# EAGLE design CC40_ROM_Cart (EAGLE 7.7.0)
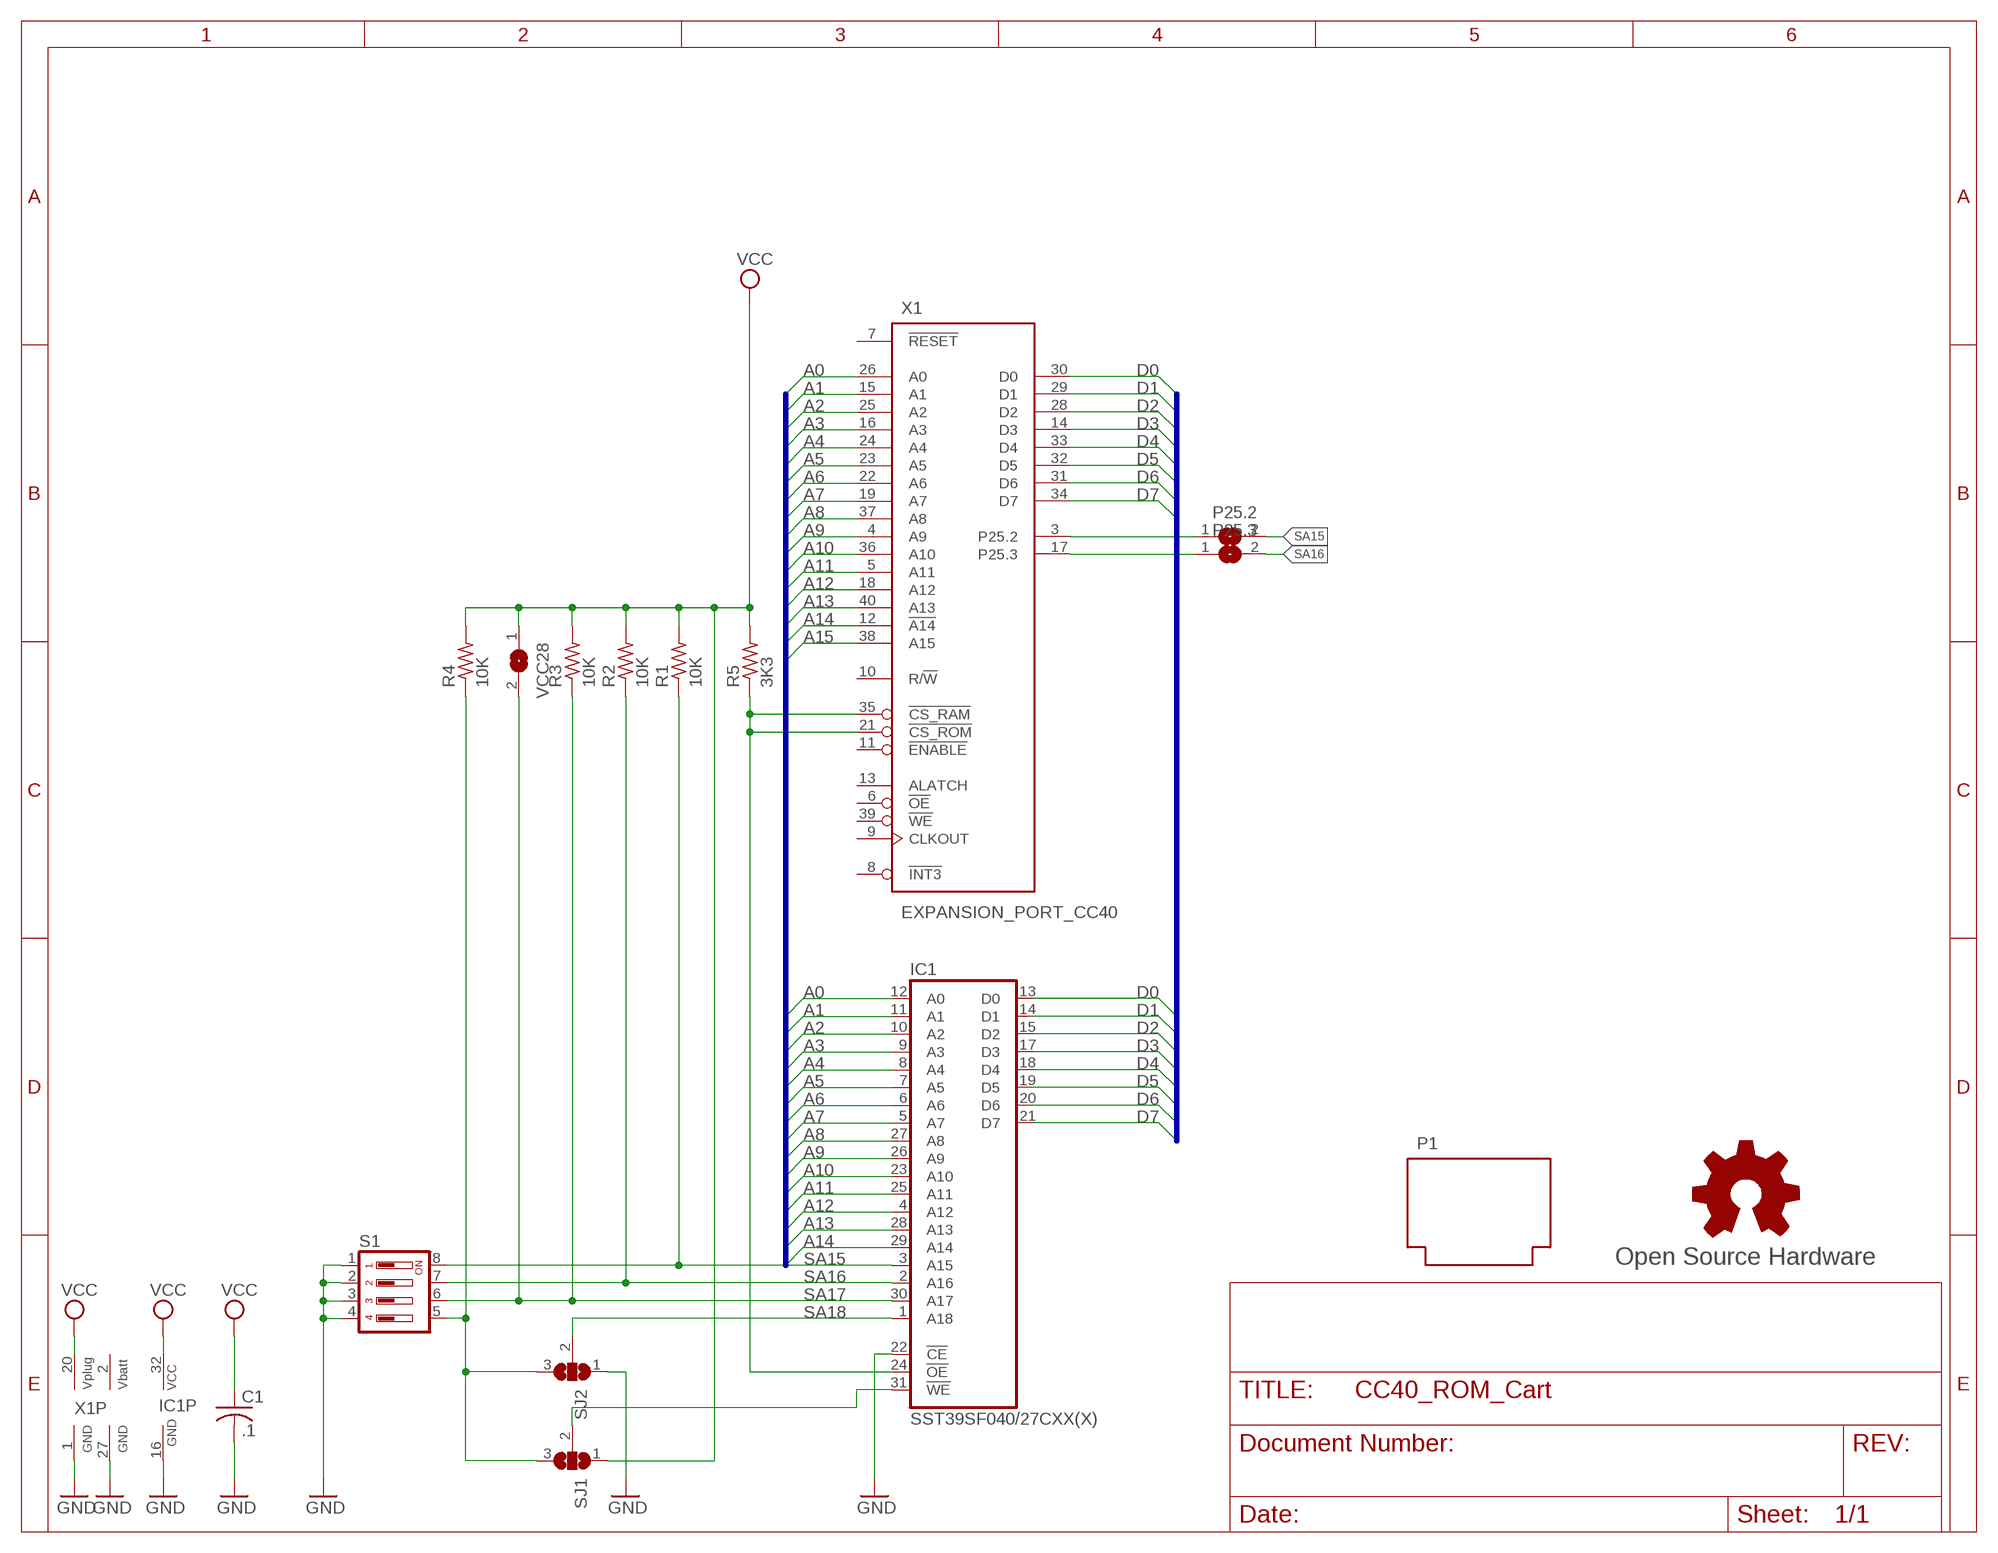
[diagram p0: schematic, sheet 1]

## Parts
C1  .1  C-US025-025X050  [C025-025X050]
GOLD_ORB_SM1  Open Source Hardware  OSHWLOGOLOGO8MM  [OSHW_8MM]
IC1  SST39SF040/27CXX(X)  SST39SF040APHR  [DIL32-RP]
P1  CC40_CARTN  [CC40_CART_NOHOLE]
P25.2  SJ  [SJ]
P25.3  SJ  [SJ]
R1  10K  R-US_0204/7  [0204/7]
R2  10K  R-US_0204/7  [0204/7]
R3  10K  R-US_0204/7  [0204/7]
R4  10K  R-US_0204/7  [0204/7]
R5  3K3  R-US_0204/7  [0204/7]
S1  DP04  [DP-04]
SJ1  SJ2W  [SJ_2]
SJ2  SJ2W  [SJ_2]
VCC28  SJ  [SJ]
X1  EXPANSION_PORT_CC40  [MA20-2(.050)]

## Nets
!CS: IC1.24(!OE) R5.1 X1.21(!CS_ROM) X1.35(!CS_RAM)
!WE: IC1.31(!WE) SJ1.2
A0: IC1.12(A0) X1.26(A0)
A1: IC1.11(A1) X1.15(A1)
A2: IC1.10(A2) X1.25(A2)
A3: IC1.9(A3) X1.16(A3)
A4: IC1.8(A4) X1.24(A4)
A5: IC1.7(A5) X1.23(A5)
A6: IC1.6(A6) X1.22(A6)
A7: IC1.5(A7) X1.19(A7)
A8: IC1.27(A8) X1.37(A8)
A9: IC1.26(A9) X1.4(A9)
A10: IC1.23(A10) X1.36(A10)
A11: IC1.25(A11) X1.5(A11)
A12: IC1.4(A12) X1.18(A12)
A13: IC1.28(A13) X1.40(A13)
A14: IC1.29(A14) X1.12(!A14)
A15: X1.38(A15)
D0: IC1.13(D0) X1.30(D0)
D1: IC1.14(D1) X1.29(D1)
D2: IC1.15(D2) X1.28(D2)
D3: IC1.17(D3) X1.14(D3)
D4: IC1.18(D4) X1.33(D4)
D5: IC1.19(D5) X1.32(D5)
D6: IC1.20(D6) X1.31(D6)
D7: IC1.21(D7) X1.34(D7)
GND: C1.2 IC1.16(GND) IC1.22(!CE) S1.1 S1.2 S1.3 S1.4 SJ2.1 X1.1(GND) X1.27(GND)
SA15: IC1.3(A15) P25.2.2 R1.1 S1.8
SA15': P25.2.1 X1.3(P25.2)
SA16: IC1.2(A16) P25.3.2 R2.1 S1.7
SA16': P25.3.1 X1.17(P25.3)
SA17: IC1.30(A17) R3.1 S1.6 VCC28.2
SA18: IC1.1(A18) SJ2.2
SA18': R4.1 S1.5 SJ1.3 SJ2.3
VCC: C1.1 IC1.32(VCC) R1.2 R2.2 R3.2 R4.2 R5.2 SJ1.1 VCC28.1 X1.20(VPLUG)
Unconnected: X1.6(!OE) X1.7(!RESET) X1.8(!INT3) X1.9(CLKOUT) X1.10(R/!W) X1.11(!ENABLE) X1.13(ALATCH) X1.39(!WE)

## Buses
A[0..15]
D[0..7]

## Power pins joined to a net without a drawn wire
VBATT: X1.2(VBATT)

## Library data of the parts
C1 = rcl:C-US: CAPACITOR, American symbol
GOLD_ORB_SM1 = oshw:OSHWLOGO: The OSHW logo for PCB layout
IC1 = memory-sst:SST39SF040A: 4 Mbit x8 Multi-Purpose Flash Source: http://www.sst.com/dotAsset/40782.pdf
P1 = ti-cc40-74-95:CC40_CART
P25.2 P25.3 VCC28 = jumper:SJ: SMD solder JUMPER
R1-R5 = rcl:R-US_: RESISTOR, American symbol
S1 = switch-dil-rp:DP04: DIL/CODE SWITCH; MPN: DP04; OC_FARNELL: 9471600; OC_NEWARK: 73J0027
SJ1 SJ2 = jumper:SJ2W: SMD solder JUMPER
X1 = ti-cc40-74-95:EXPANSION_PORT_CC40

## Board
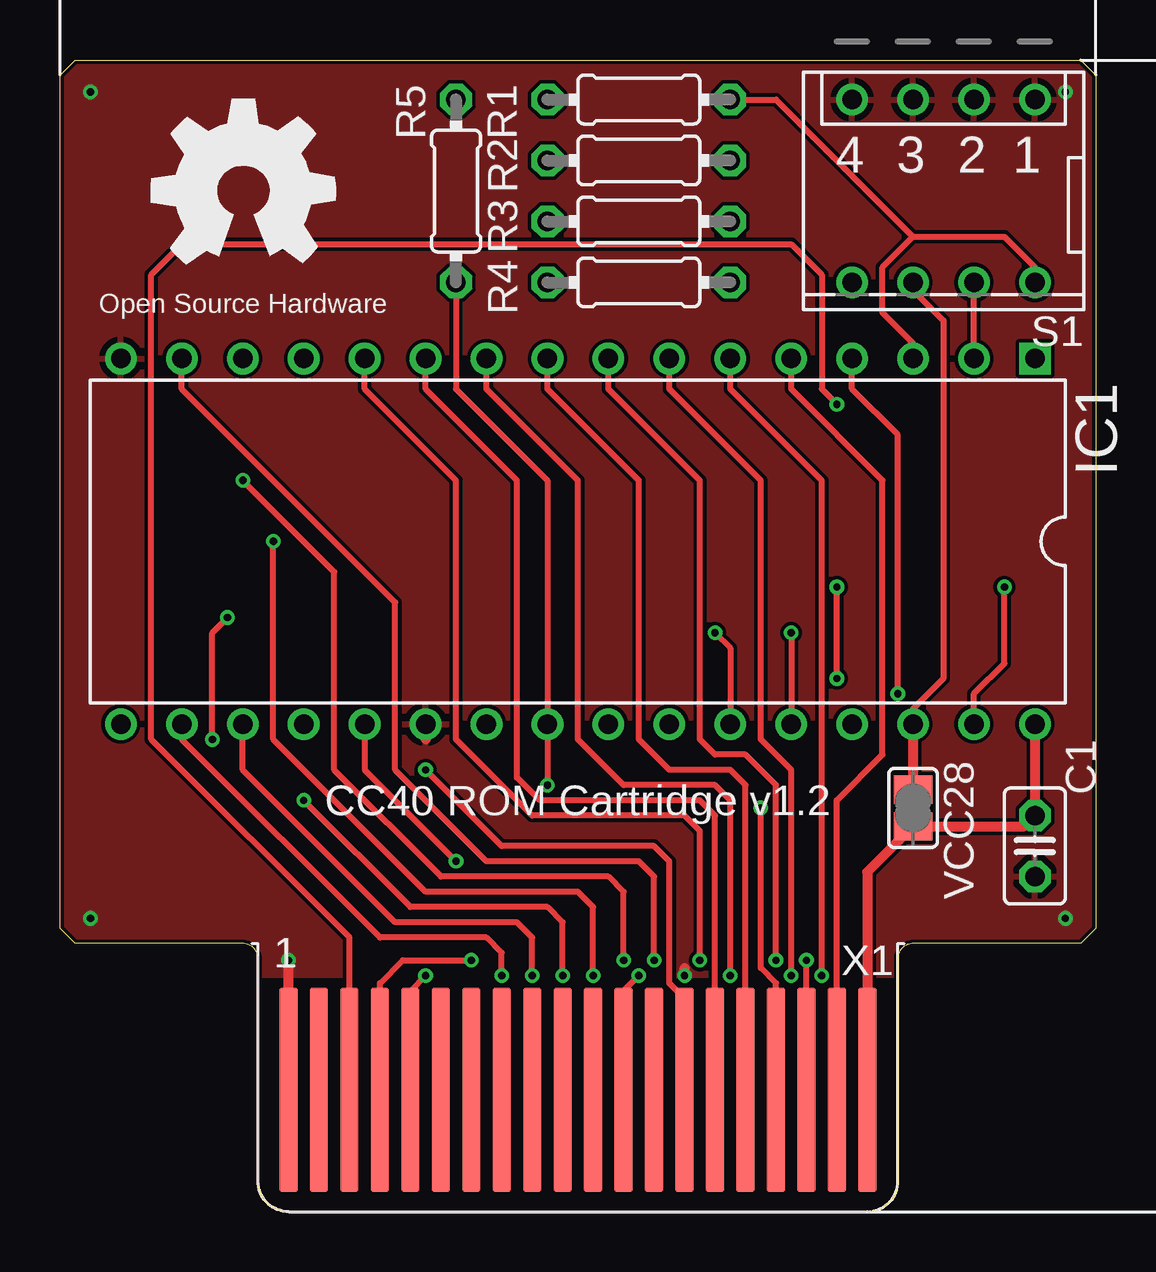
[diagram p1: board, top side]
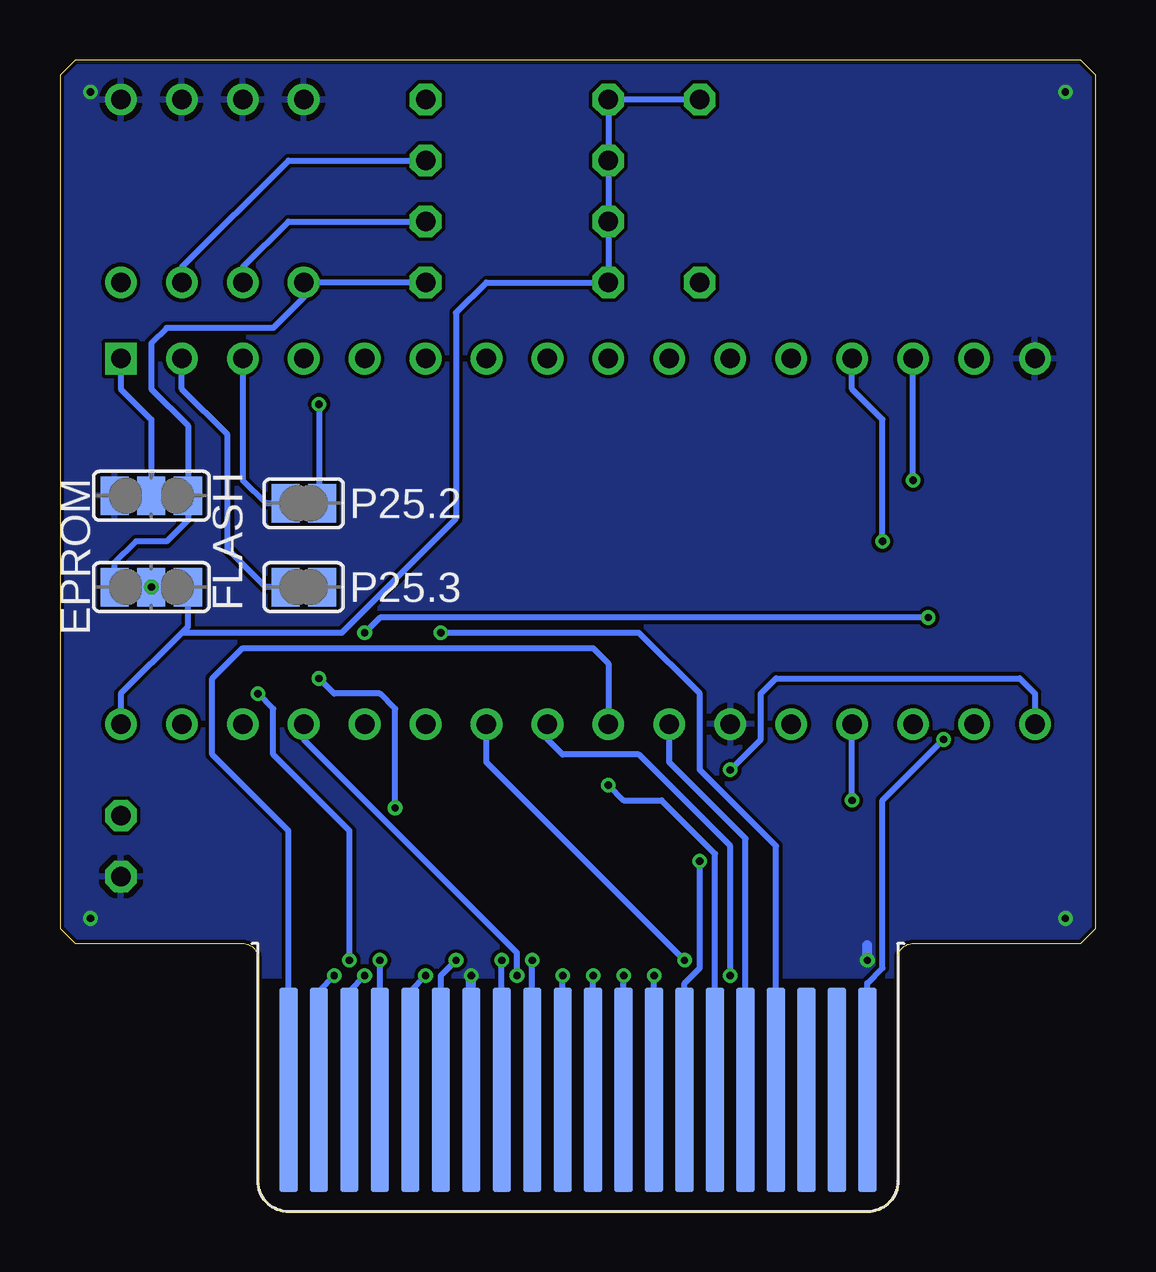
[diagram p2: board, bottom side, seen from below]

Size 43.18 x 48.01 mm. Coordinates in mm from the lower left corner, seen from the top.
Outline: 8.25,1.27 8.25,10.54 arc90 7.62,11.18 0.64,11.18 0,11.81 0,47.37 0.64,48.01 42.55,48.01 43.18,47.37 43.18,11.81 42.55,11.18 35.56,11.18 arc90 34.92,10.54 34.92,1.27 arc-90 33.66,0 9.53,0 arc-90 8.25,1.27
Copper layers (1*16): Top 0.035mm / dielectric 1.5mm / Bottom 0.035mm
Design rules "hackvana *": minimum track width 6mil, minimum drill 0.3mm, track to track 6mil, track to pad 6mil, pad to pad 6mil, via to via 6mil, smd to smd 0mil, copper to edge 6mil, drill to drill 6mil, minimum pad ring 10mil, minimum via ring 6mil, stop-mask expansion 2mil, vias tented up to drill 100mil, thermal gap 10mil

### Footprints (pad centres in the part's own frame; a part is rotated, then mirrored left to right if it is on the bottom)
C025-025X050 = drill 0.813 octagon: 1 -1.27,0; 2 1.27,0
DIL32-RP = drill 0.813 square: 1 -19.05,-7.62 | drill 0.813: 2 -16.51,-7.62; 3 -13.97,-7.62; 4 -11.43,-7.62; 5 -8.89,-7.62; 6 -6.35,-7.62; 7 -3.81,-7.62; 8 -1.27,-7.62; 9 1.27,-7.62; 10 3.81,-7.62; 11 6.35,-7.62; 12 8.89,-7.62; 13 11.43,-7.62; 14 13.97,-7.62; 15 16.51,-7.62; 16 19.05,-7.62; 17 19.05,7.62; 18 16.51,7.62; 19 13.97,7.62; 20 11.43,7.62; 21 8.89,7.62; 22 6.35,7.62; 23 3.81,7.62; 24 1.27,7.62; 25 -1.27,7.62; 26 -3.81,7.62; 27 -6.35,7.62; 28 -8.89,7.62; 29 -11.43,7.62; 30 -13.97,7.62; 31 -16.51,7.62; 32 -19.05,7.62
SJ = smd 1.168 x 1.6: 1 -0.762,0; 2 0.762,0
0204/7 = drill 0.813 octagon: 1 -3.81,0; 2 3.81,0
DP-04 = drill 0.813: 1 -3.81,-3.81; 2 -1.27,-3.81; 3 1.27,-3.81; 4 3.81,-3.81; 5 3.81,3.81; 6 1.27,3.81; 7 -1.27,3.81; 8 -3.81,3.81
SJ_2 = smd 1.168 x 1.6: 1 -1.524,0; 2 0,0; 3 1.524,0
MA20-2(.050) = smd 0.762 x 8.534: 1 -12.065,0; 2 -10.795,0; 3 -9.525,0; 4 -8.255,0; 5 -6.985,0; 6 -5.715,0; 7 -4.445,0; 8 -3.175,0; 9 -1.905,0; 10 -0.635,0; 11 0.635,0; 12 1.905,0; 13 3.175,0; 14 4.445,0; 15 5.715,0; 16 6.985,0; 17 8.255,0; 18 9.525,0; 19 10.795,0; 20 12.065,0 | smd 0.762 x 8.534 bottom: 21 12.065,0; 22 10.795,0; 23 9.525,0; 24 8.255,0; 25 6.985,0; 26 5.715,0; 27 4.445,0; 28 3.175,0; 29 1.905,0; 30 0.635,0; 31 -0.635,0; 32 -1.905,0; 33 -3.175,0; 34 -4.445,0; 35 -5.715,0; 36 -6.985,0; 37 -8.255,0; 38 -9.525,0; 39 -10.795,0; 40 -12.065,0

### Placement (x,y rotation side)
C1  40.64,15.24 270 top
GOLD_ORB_SM1  7.62,42.55 0 top
IC1  21.59,27.94 180 top
P1  21.59,0 0 top
P25.2  33.02,29.53 180 bottom
P25.3  33.02,26.04 180 bottom
R1  24.13,46.35 180 top
R2  24.13,43.81 180 top
R3  24.13,41.27 180 top
R4  24.13,38.73 180 top
R5  16.51,42.55 90 top
S1  36.83,42.55 180 top
SJ1  39.37,26.04 180 bottom
SJ2  39.37,29.84 0 bottom
VCC28  35.56,16.83 90 top
X1  21.59,5.08 0 top

### Tracks (layer width: path | path; a pad name or v marks a point on that pad's centre or on a via)
!CS  (via drill 0.3)
  Top 0.254: R5.1 16.51,34.29 20.32,30.48 IC1.24 v20.32,17.78
  Bottom 0.254: IC1.24 20.32,22.86 20.95,23.5 35.56,23.5 36.83,22.23 36.83,19.05 33.66,15.88 X1.21 33.66,4.76 | X1.35 15.88,14.92 18.1,17.14 19.68,17.14 v20.32,17.78
!WE  (via drill 0.3)
  Top 0.254: IC1.31 38.1,21.59 39.37,22.86 SJ1.2
  Bottom 0.254: 40.64,26.04 SJ1.2
  other vias: 39.37,26.04
A0  (via drill 0.3)
  Top 0.254: v26.67,10.48 26.67,15.88 26.04,16.51 19.68,16.51 16.51,19.68 16.51,30.48 12.7,34.29 IC1.12
  Bottom 0.254: X1.26 27.3,9.84 v26.67,10.48
A1
  Top 0.254: X1.15 27.3,16.51 26.67,17.14 20,17.14 19.05,18.1 19.05,30.48 15.24,34.29 IC1.11
A2  (via drill 0.3)
  Top 0.254: v27.94,9.84 27.94,17.14 27.3,17.78 23.5,17.78 21.59,19.68 21.59,30.48 17.78,34.29 IC1.10
  Bottom 0.254: X1.25 28.57,9.21 v27.94,9.84
A3
  Top 0.254: X1.16 28.57,17.78 27.94,18.41 25.4,18.41 24.13,19.68 24.13,30.48 20.32,34.29 IC1.9
A4  (via drill 0.3)
  Top 0.254: v29.84,10.48 29.84,17.78 28.57,19.05 27.3,19.05 26.67,19.68 26.67,30.48 22.86,34.29 IC1.8
  Bottom 0.254: X1.24 v29.84,10.48
A5  (via drill 0.3)
  Top 0.254: v30.48,9.84 30.48,18.41 29.21,19.68 29.21,30.48 25.4,34.29 IC1.7
  Bottom 0.254: X1.23 31.12,9.21 v30.48,9.84
A6  (via drill 0.3)
  Top 0.254: v31.75,9.84 31.75,30.48 27.94,34.29 IC1.6
  Bottom 0.254: X1.22 32.38,9.21 v31.75,9.84
A7
  Top 0.254: X1.19 32.38,17.14 34.29,19.05 34.29,30.48 30.48,34.29 IC1.5
A8  (via drill 0.3)
  Top 0.254: v27.3,24.13 27.94,23.5 IC1.27
  Bottom 0.254: X1.37 13.33,15.24 16.51,18.41 16.51,21.59 19.05,24.13 v27.3,24.13
A9  (via drill 0.3)
  Top 0.254: X1.4 13.33,9.53 14.29,10.48 v17.14,10.48
  Bottom 0.254: v17.14,10.48 25.4,18.73 IC1.26
A10
  Bottom 0.254: X1.36 14.61,15.56 17.78,18.73 IC1.23
A11  (via drill 0.3)
  Top 0.254: X1.5 14.61,9.21 v15.24,9.84
  Bottom 0.254: IC1.25 22.86,19.68 22.23,19.05 19.05,19.05 15.24,15.24 v15.24,9.84
A12  (via drill 0.3)
  Top 0.254: X1.18 v31.12,10.48 | v34.92,21.59 34.92,32.38 33.02,34.29 IC1.4
  Bottom 0.254: v31.12,10.48 31.12,15.88 34.29,19.05 34.29,20.95 v34.92,21.59
A13  (via drill 0.3)
  Top 0.254: v6.35,19.68 6.35,24.13 v6.98,24.77 | v30.48,24.13 IC1.28
  Bottom 0.254: X1.40 9.53,9.53 8.89,10.16 8.89,17.14 v6.35,19.68 | v6.98,24.77 29.84,24.77 v30.48,24.13
A14  (via drill 0.3)
  Top 0.254: X1.12 23.5,9.21 v24.13,9.84
  Bottom 0.254: v24.13,9.84 24.13,10.79 33.02,19.68 IC1.29
D0  (via drill 0.3)
  Top 0.254: v22.23,9.84 22.23,12.7 21.59,13.34 15.24,13.34 8.89,19.68 v8.89,27.94
  Bottom 0.254: X1.30 v22.23,9.84 | v8.89,27.94 8.89,33.02 10.16,34.29 IC1.13
D1  (via drill 0.3)
  Top 0.254: v23.5,10.48 23.5,13.34 22.86,13.97 15.88,13.97 11.43,18.41 11.43,26.67 v7.62,30.48
  Bottom 0.254: X1.29 v23.5,10.48 | v7.62,30.48 IC1.14
D2  (via drill 0.3)
  Top 0.254: v24.77,10.48 24.77,13.97 24.13,14.61 17.78,14.61 13.97,18.41 13.97,25.4 5.08,34.29 IC1.15
  Bottom 0.254: X1.28 v24.77,10.48
D3  (via drill 0.3)
  Top 0.254: X1.14 26.04,8.89 25.4,9.53 25.4,14.61 24.77,15.24 18.41,15.24 v15.24,18.41
  Bottom 0.254: v15.24,18.41 13.97,19.68 13.97,21.59 13.33,22.23 3.18,22.23 2.54,21.59 IC1.17
D4  (via drill 0.3)
  Top 0.254: v18.41,9.84 18.41,10.79 17.78,11.43 13.33,11.43 5.08,19.68 IC1.18
  Bottom 0.254: X1.33 v18.41,9.84
D5  (via drill 0.3)
  Top 0.254: v19.68,9.84 19.68,11.43 19.05,12.06 13.97,12.06 7.62,18.41 IC1.19
  Bottom 0.254: X1.32 v19.68,9.84
D6  (via drill 0.3)
  Top 0.254: v20.95,9.84 20.95,12.06 20.32,12.7 14.61,12.7 v10.16,17.14
  Bottom 0.254: X1.31 v20.95,9.84 | v10.16,17.14 IC1.20
D7  (via drill 0.3)
  Top 0.254: IC1.21 12.7,18.41 v16.51,14.61
  Bottom 0.254: X1.34 17.14,9.53 16.51,10.16 v16.51,14.61
GND  (via drill 0.3)
  Top 0.254: 9.53,4.12 X1.1
  Top 0.406: 15.24,19.68 IC1.22 | v26.04,9.84 26.04,10.16 | X1.1 v9.53,10.48
  Bottom 0.254: X1.27 26.04,4.12
  Bottom 0.406: X1.27 v26.04,9.84 | v9.53,10.48 9.53,11.11
  other vias: 1.27,46.67 1.27,12.22 41.91,12.22 41.91,46.67
  pour Bottom: 8.25,9.84 8.25,10.54 arc90 7.62,11.18 0.64,11.18 0,11.81 0,47.37 0.64,48.01 42.55,48.01 43.18,47.37 43.18,11.81 42.55,11.18 35.56,11.18 arc90 34.92,10.54 34.92,9.84
  pour Top: 8.25,9.84 8.25,10.54 arc90 7.62,11.18 0.64,11.18 0,11.81 0,47.37 0.64,48.01 42.55,48.01 43.18,47.37 43.18,11.81 42.55,11.18 35.56,11.18 arc90 34.92,10.54 34.92,9.84
SA15
  Top 0.254: IC1.3 35.56,36.2 34.29,37.47 34.29,39.37 35.56,40.64 | 35.56,40.64 39.37,40.64 40.64,39.37 S1.8 | R1.1 29.84,46.35 35.56,40.64
  Bottom 0.254: IC1.3 35.56,30.48 34.61,29.53 P25.2.2
SA15'  (via drill 0.3)
  Top 0.254: X1.3 12.06,11.43 3.81,19.68 3.81,39.05 5.08,40.32 30.48,40.32 31.75,39.05 31.75,34.29 v32.38,33.66
  Bottom 0.254: v32.38,33.66 32.38,29.65 P25.2.1
SA16
  Top 0.254: IC1.2 S1.7
  Bottom 0.254: S1.7 38.1,39.37 33.66,43.81 R2.1 | P25.3.2 34.61,26.04 36.2,27.62 36.2,32.38 38.1,34.29 IC1.2
SA16'  (via drill 0.3)
  Top 0.254: X1.17 29.84,9.53 29.21,10.16 v29.21,16.83 | v32.38,22.23 v32.38,26.04
  Bottom 0.254: v29.21,16.83 29.21,20.95 29.84,21.59 31.75,21.59 v32.38,22.23 | v32.38,26.04 P25.3.1
SA17
  Top 0.254: S1.6 35.56,38.42 36.83,37.15 36.83,22.23 35.56,20.95 IC1.30
  Top 0.406: IC1.30 VCC28.2
  Bottom 0.254: S1.6 35.56,39.37 33.66,41.27 R3.1
SA18
  Bottom 0.254: IC1.1 40.64,34.29 39.37,33.02 SJ2.2 40.64,29.84
SA18'
  Bottom 0.254: R4.1 S1.5 33.02,38.1 34.29,36.83 38.73,36.83 39.37,36.2 39.37,34.29 37.85,32.77 SJ2.3 37.85,28.83 38.73,27.94 40,27.94 40.89,27.05 SJ1.3
VBATT
  Top 0.254: 10.79,4.12 X1.2
VCC
  Top 0.406: IC1.32 C1.1 40.2,16.07 VCC28.1 33.66,14.16 X1.20
  Bottom 0.254: R5.2 R1.2 R2.2 R3.2 R4.2 25.4,38.73 26.67,37.47 26.67,28.89 31.43,24.13 38.1,24.13 | IC1.32 40.64,21.59 38.1,24.13 | 38.1,24.13 37.85,24.38 SJ1.1

### Text on the board
tNames: CC40 ROM Cartridge v1.2
bNames: FLASH | EPROM
tValues: (c) 2017 RETRO Innovations / http://www.go4retro.com